# Altium schematic sheet SEC_3002_DZ&HL.SchDoc
size A4
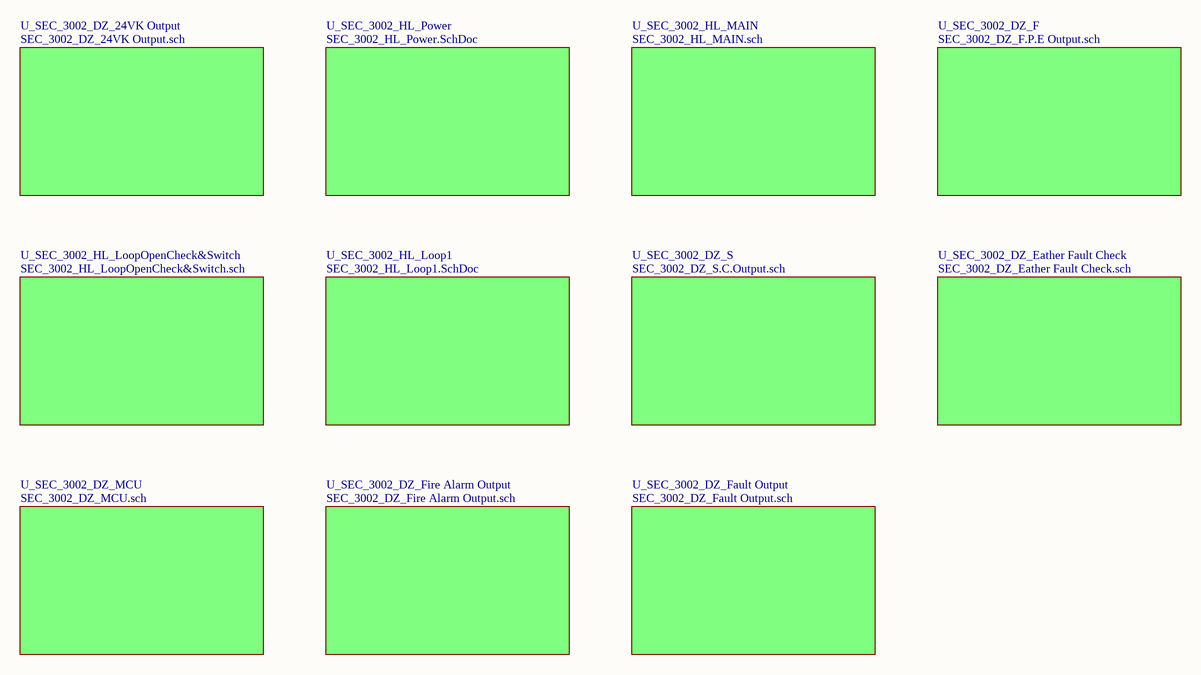
[diagram p0: SEC_3002_DZ&HL.SchDoc]

## Sub-sheets
U_SEC_3002_DZ_24VK Output = SEC_3002_DZ_24VK Output.sch: no entries
U_SEC_3002_DZ_Eather Fault Check = SEC_3002_DZ_Eather Fault Check.sch: no entries
U_SEC_3002_DZ_F = SEC_3002_DZ_F.P.E Output.sch: no entries
U_SEC_3002_DZ_Fault Output = SEC_3002_DZ_Fault Output.sch: no entries
U_SEC_3002_DZ_Fire Alarm Output = SEC_3002_DZ_Fire Alarm Output.sch: no entries
U_SEC_3002_DZ_MCU = SEC_3002_DZ_MCU.sch: no entries
U_SEC_3002_DZ_S = SEC_3002_DZ_S.C.Output.sch: no entries
U_SEC_3002_HL_Loop1 = SEC_3002_HL_Loop1.SchDoc: no entries
U_SEC_3002_HL_LoopOpenCheck&Switch = SEC_3002_HL_LoopOpenCheck&Switch.sch: no entries
U_SEC_3002_HL_MAIN = SEC_3002_HL_MAIN.sch: no entries
U_SEC_3002_HL_Power = SEC_3002_HL_Power.SchDoc: no entries